# EAGLE design v0.1 (EAGLE 9.3.0)
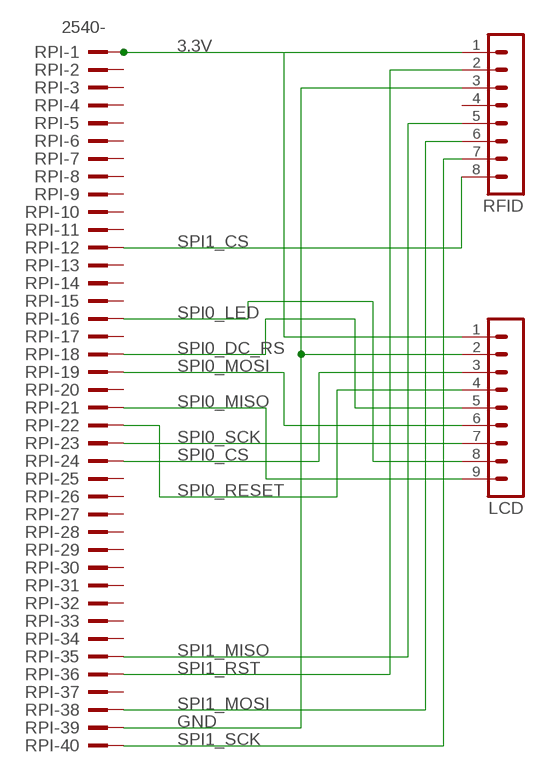
[diagram p0: schematic, sheet 1]

## Parts
LCD  MA09-1  [MA09-1]
RFID  MA08-1  [MA08-1]
RPI  2540-  [PAK100/2500-40]

## Nets
3.3V: LCD.1 RFID.1 RPI.1
GND: LCD.2 RFID.3 RPI.39
SPI0_CS: LCD.3 RPI.24
SPI0_DC_RS: LCD.5 RPI.18
SPI0_LED: LCD.8 RPI.16
SPI0_MISO: LCD.9 RPI.21
SPI0_MOSI: LCD.6 RPI.19
SPI0_RESET: LCD.4 RPI.22
SPI0_SCK: LCD.7 RPI.23
SPI1_CS: RFID.8 RPI.12
SPI1_MISO: RFID.5 RPI.35
SPI1_MOSI: RFID.6 RPI.38
SPI1_RST: RFID.2 RPI.36
SPI1_SCK: RFID.7 RPI.40
Unconnected: RFID.4 RPI.2 RPI.3 RPI.4 RPI.5 RPI.6 RPI.7 RPI.8 RPI.9 RPI.10 RPI.11 RPI.13 RPI.14 RPI.15 RPI.17 RPI.20 RPI.25 RPI.26 RPI.27 RPI.28 RPI.29 RPI.30 RPI.31 RPI.32 RPI.33 RPI.34 RPI.37

## Library data of the parts
LCD = con-lstb:MA09-1: PIN HEADER; OC_FARNELL: unknown; OC_NEWARK: unknown
RFID = con-lstb:MA08-1: PIN HEADER; OC_FARNELL: unknown; OC_NEWARK: unknown
RPI = con-3m:2540-: 3M (TM) Pak 100 4-Wall Header Source: 3M; OC_FARNELL: unknown; OC_NEWARK: unknown

## Board
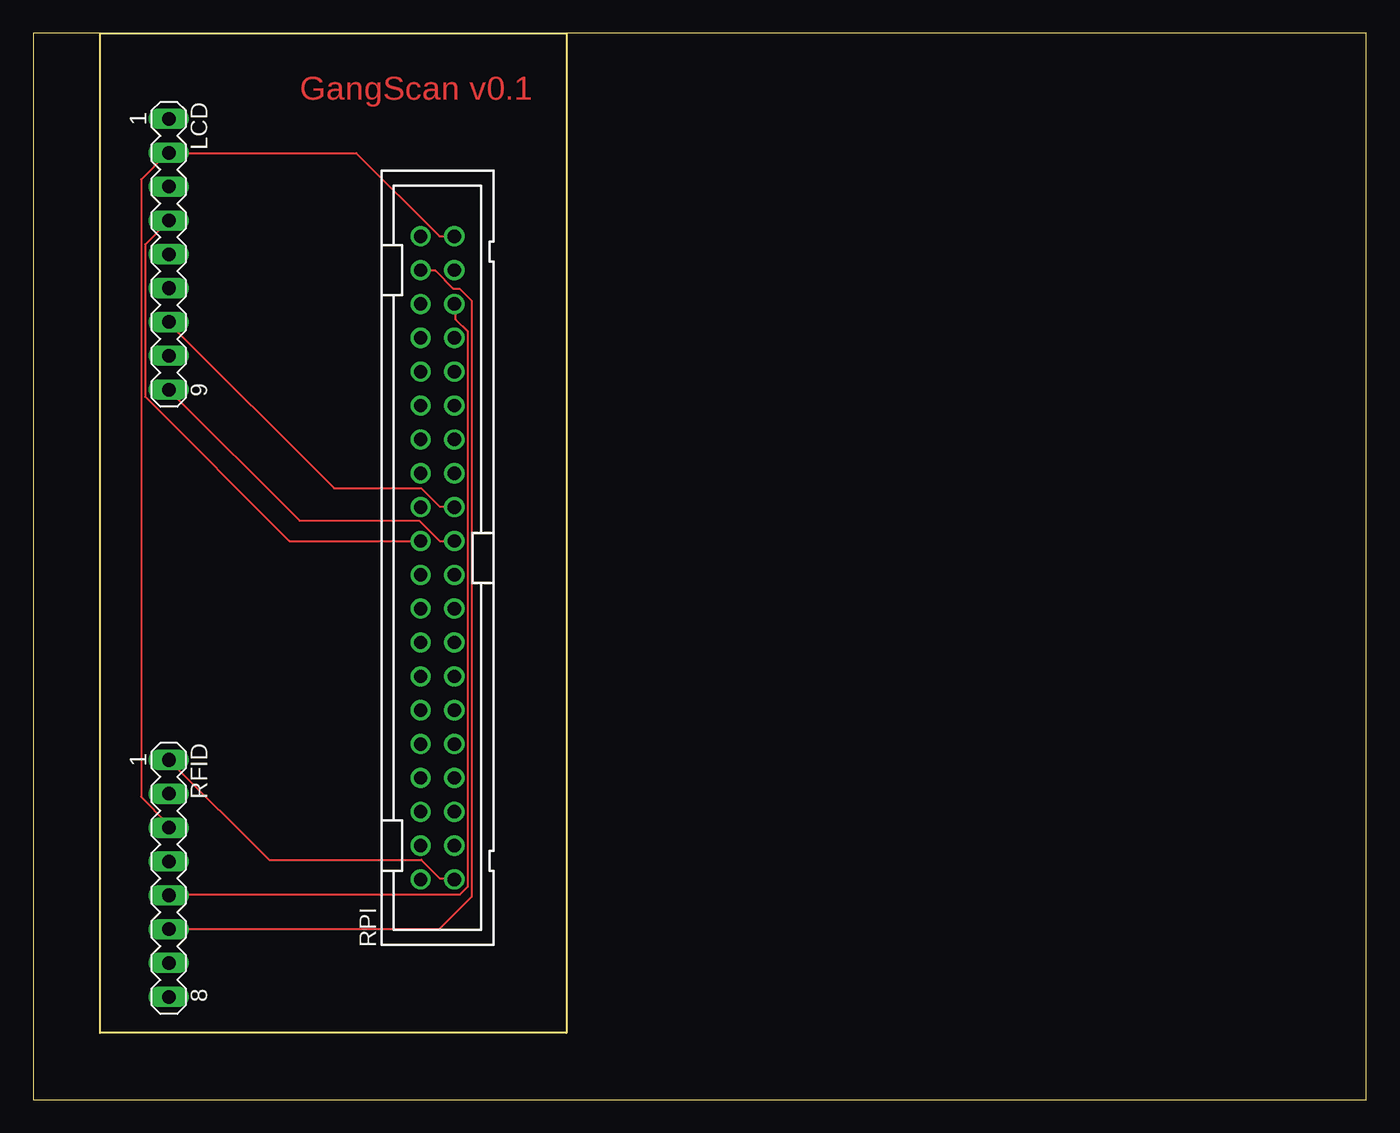
[diagram p1: board, top side]
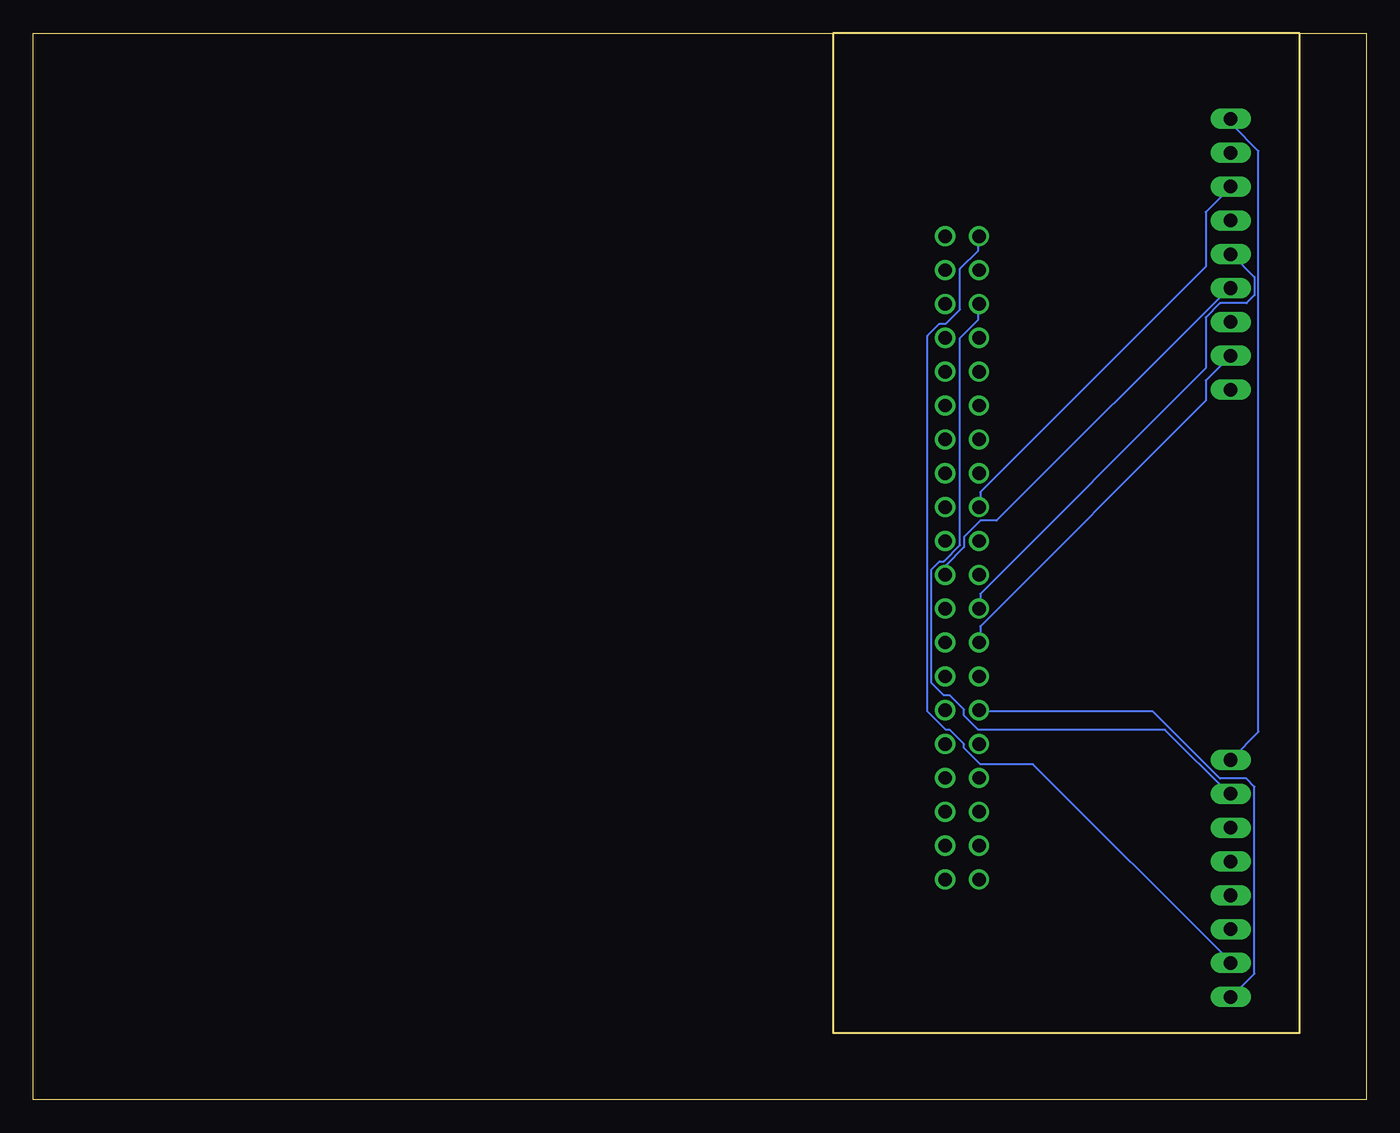
[diagram p2: board, bottom side, seen from below]

Size 100 x 80 mm. Coordinates in mm from the lower left corner, seen from the top.
Outline: 40,80 100,80 100,0 0,0 0,80 5,80
Outline: 5,80 5,5 40,5 40,80
Outline: 5,80 40,80
Copper layers (1*16): Top 0.035mm / dielectric 1.5mm / Bottom 0.035mm
Design rules "default": minimum track width 6mil, minimum drill 0.35mm, track to track 6mil, track to pad 6mil, pad to pad 6mil, via to via 6mil, smd to smd 6mil, copper to edge 40mil, drill to drill 6mil, minimum pad ring 10mil, minimum via ring 8mil, stop-mask expansion 4mil, vias tented up to drill 0mil, thermal gap 10mil

### Footprints (pad centres in the part's own frame; a part is rotated, then mirrored left to right if it is on the bottom)
MA09-1 = drill 1.016 long: 1 -10.16,0; 2 -7.62,0; 3 -5.08,0; 4 -2.54,0; 5 0,0; 6 2.54,0; 7 5.08,0; 8 7.62,0; 9 10.16,0
MA08-1 = drill 1.016 long: 1 -8.89,0; 2 -6.35,0; 3 -3.81,0; 4 -1.27,0; 5 1.27,0; 6 3.81,0; 7 6.35,0; 8 8.89,0
PAK100/2500-40 = drill 1 pad 1.422: 1 -24.13,-1.27; 2 -24.13,1.27; 3 -21.59,-1.27; 4 -21.59,1.27; 5 -19.05,-1.27; 6 -19.05,1.27; 7 -16.51,-1.27; 8 -16.51,1.27; 9 -13.97,-1.27; 10 -13.97,1.27; 11 -11.43,-1.27; 12 -11.43,1.27; 13 -8.89,-1.27; 14 -8.89,1.27; 15 -6.35,-1.27; 16 -6.35,1.27; 17 -3.81,-1.27; 18 -3.81,1.27; 19 -1.27,-1.27; 20 -1.27,1.27; 21 1.27,-1.27; 22 1.27,1.27; 23 3.81,-1.27; 24 3.81,1.27; 25 6.35,-1.27; 26 6.35,1.27; 27 8.89,-1.27; 28 8.89,1.27; 29 11.43,-1.27; 30 11.43,1.27; 31 13.97,-1.27; 32 13.97,1.27; 33 16.51,-1.27; 34 16.51,1.27; 35 19.05,-1.27; 36 19.05,1.27; 37 21.59,-1.27; 38 21.59,1.27; 39 24.13,-1.27; 40 24.13,1.27

### Placement (x,y rotation side)
LCD  10.16,63.42 270 top
RFID  10.16,16.59 270 top
RPI  30.32,40.64 90 top

### Tracks (layer width: path | path; a pad name or v marks a point on that pad's centre or on a via)
3.3V
  Top 0.152: RPI.1 31.55,16.61 30.48,16.61 29.11,17.98 17.68,17.98 10.21,25.45 RFID.1
  Bottom 0.152: LCD.1 10.06,73.46 10.06,73.15 8.08,71.17 8.08,27.58 10.06,25.6 RFID.1
GND
  Top 0.152: RPI.39 30.48,64.77 24.23,71.02 10.21,71.02 LCD.2 10.06,71.02 8.08,69.04 8.08,22.71 10.06,20.73 10.06,20.42 RFID.3
SPI0_CS
  Bottom 0.152: RPI.24 28.96,44.5 28.96,45.57 12.04,62.48 12.04,66.6 10.21,68.43 LCD.3
SPI0_DC_RS
  Bottom 0.152: RPI.18 28.96,36.88 28.96,37.95 12.04,54.86 12.04,58.67 10.97,59.74 8.99,59.74 8.38,60.35 8.38,61.72 10.06,63.4 LCD.5
SPI0_LED
  Bottom 0.152: RPI.16 28.96,34.29 28.96,35.51 12.04,52.43 12.04,53.95 10.21,55.78 LCD.8
SPI0_MISO
  Top 0.152: RPI.21 30.48,41.91 28.96,43.43 19.96,43.43 10.21,53.19 LCD.9
SPI0_MOSI
  Bottom 0.152: RPI.19 31.55,39.47 31.55,40.08 30.18,41.45 30.18,42.22 28.96,43.43 27.74,43.43 10.21,60.96 LCD.6
SPI0_RESET
  Top 0.152: RPI.22 19.2,41.91 8.38,52.73 8.38,64.16 10.06,65.84 LCD.4
SPI0_SCK
  Top 0.152: RPI.23 31.55,44.5 30.48,44.5 29.11,45.87 22.55,45.87 10.21,58.22 LCD.7
SPI1_CS
  Bottom 0.152: RPI.12 28.96,29.11 16,29.11 10.97,24.08 8.99,24.08 8.38,23.47 8.38,9.45 10.06,7.77 RFID.8
SPI1_MISO
  Top 0.152: RPI.35 31.7,59.59 31.7,58.52 32.61,57.61 32.61,16 32,15.39 10.21,15.39 RFID.5
SPI1_MOSI
  Top 0.152: RPI.38 29.11,62.18 30.18,62.18 31.55,60.81 32,60.81 32.92,59.89 32.92,15.24 30.48,12.8 10.21,12.8 RFID.6
SPI1_RST
  Bottom 0.152: RPI.36 29.11,59.59 29.11,58.52 30.48,57.15 30.48,41.6 31.7,40.39 32,40.39 32.61,39.78 32.61,31.24 31.7,30.33 31.24,30.33 30.18,29.26 30.18,28.8 29.11,27.74 15.09,27.74 10.21,22.86 RFID.2
SPI1_SCK
  Bottom 0.152: RPI.40 29.11,64.77 29.11,63.7 30.48,62.33 30.48,59.28 31.55,58.22 32,58.22 32.92,57.3 32.92,29.11 31.55,27.74 31.24,27.74 30.18,26.67 30.18,26.36 28.96,25.15 24.99,25.15 10.21,10.36 RFID.7

### Text on the board
Top: GangScan v0.1